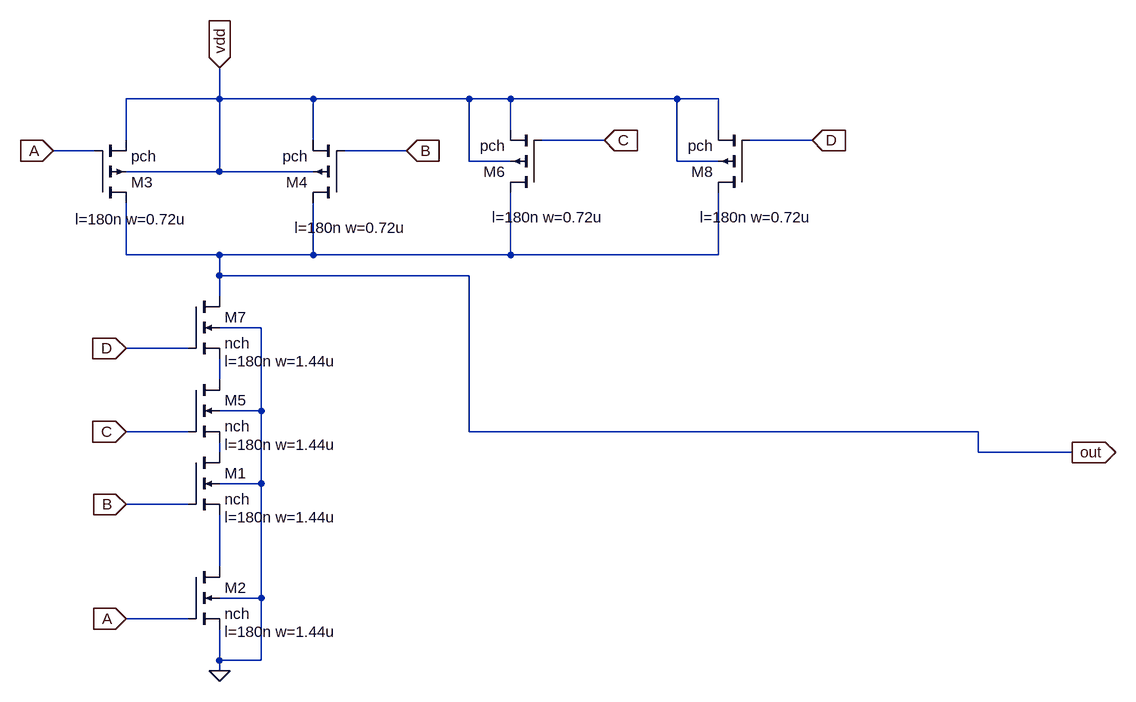
[diagram p0: schematic NAND_4.asc]
NAND_4.asc, the LTspice schematic file:
Version 4
SHEET 1 1952 964
WIRE 544 64 544 16
WIRE 544 64 400 64
WIRE 688 64 544 64
WIRE 928 64 688 64
WIRE 992 64 928 64
WIRE 1248 64 992 64
WIRE 1312 64 1248 64
WIRE 992 112 992 64
WIRE 1312 112 1312 64
WIRE 400 128 400 64
WIRE 688 128 688 64
WIRE 1136 128 1040 128
WIRE 1456 128 1360 128
WIRE 352 144 288 144
WIRE 832 144 736 144
WIRE 928 160 928 64
WIRE 992 160 928 160
WIRE 1248 160 1248 64
WIRE 1312 160 1248 160
WIRE 544 176 544 64
WIRE 544 176 400 176
WIRE 688 176 544 176
WIRE 400 304 400 224
WIRE 544 304 400 304
WIRE 688 304 688 224
WIRE 688 304 544 304
WIRE 992 304 992 208
WIRE 992 304 688 304
WIRE 1312 304 1312 208
WIRE 1312 304 992 304
WIRE 544 336 544 304
WIRE 928 336 544 336
WIRE 544 368 544 336
WIRE 608 416 544 416
WIRE 496 448 400 448
WIRE 544 496 544 464
WIRE 608 544 608 416
WIRE 608 544 544 544
WIRE 496 576 400 576
WIRE 928 576 928 336
WIRE 1712 576 928 576
WIRE 544 608 544 592
WIRE 1712 608 1712 576
WIRE 1856 608 1712 608
WIRE 608 656 608 544
WIRE 608 656 544 656
WIRE 496 688 400 688
WIRE 544 784 544 704
WIRE 608 832 608 656
WIRE 608 832 544 832
WIRE 496 864 400 864
WIRE 544 928 544 880
WIRE 608 928 608 832
WIRE 608 928 544 928
WIRE 544 944 544 928
FLAG 1856 608 out
IOPIN 1856 608 Out
FLAG 544 944 0
FLAG 544 16 vdd
IOPIN 544 16 In
FLAG 288 144 A
IOPIN 288 144 In
FLAG 400 864 A
IOPIN 400 864 In
FLAG 400 688 B
IOPIN 400 688 In
FLAG 832 144 B
IOPIN 832 144 In
FLAG 400 576 C
IOPIN 400 576 In
FLAG 1136 128 C
IOPIN 1136 128 In
FLAG 400 448 D
IOPIN 400 448 In
FLAG 1456 128 D
IOPIN 1456 128 In
SYMBOL nmos4 496 784 R0
WINDOW 123 56 100 Left 2
SYMATTR Value2 l=180n w=1.44u
SYMATTR InstName M2
SYMATTR Value nch
SYMBOL nmos4 496 608 R0
WINDOW 123 56 100 Left 2
SYMATTR Value2 l=180n w=1.44u
SYMATTR InstName M1
SYMATTR Value nch
SYMBOL pmos4 352 224 M180
WINDOW 123 -30 -25 Left 2
SYMATTR Value2 l=180n w=0.72u
SYMATTR InstName M3
SYMATTR Value pch
SYMBOL pmos4 736 224 R180
WINDOW 123 -96 -38 Left 2
SYMATTR Value2 l=180n w=0.72u
SYMATTR InstName M4
SYMATTR Value pch
SYMBOL nmos4 496 496 R0
WINDOW 123 56 100 Left 2
SYMATTR Value2 l=180n w=1.44u
SYMATTR InstName M5
SYMATTR Value nch
SYMBOL pmos4 1040 208 R180
WINDOW 123 -96 -38 Left 2
SYMATTR Value2 l=180n w=0.72u
SYMATTR InstName M6
SYMATTR Value pch
SYMBOL nmos4 496 368 R0
WINDOW 123 56 100 Left 2
SYMATTR Value2 l=180n w=1.44u
SYMATTR InstName M7
SYMATTR Value nch
SYMBOL pmos4 1360 208 R180
WINDOW 123 -96 -38 Left 2
SYMATTR Value2 l=180n w=0.72u
SYMATTR InstName M8
SYMATTR Value pch

The netlist it stands for:
* NAND_4.asc
M2 N003 A 0 0 nch l=180n w=1.44u
M1 N002 B N003 0 nch l=180n w=1.44u
M3 out A vdd vdd pch l=180n w=0.72u
M4 out B vdd vdd pch l=180n w=0.72u
M5 N001 C N002 0 nch l=180n w=1.44u
M6 out C vdd vdd pch l=180n w=0.72u
M7 out D N001 0 nch l=180n w=1.44u
M8 out D vdd vdd pch l=180n w=0.72u
.model NMOS NMOS
.model PMOS PMOS
.lib standard.mos
.backanno
.end